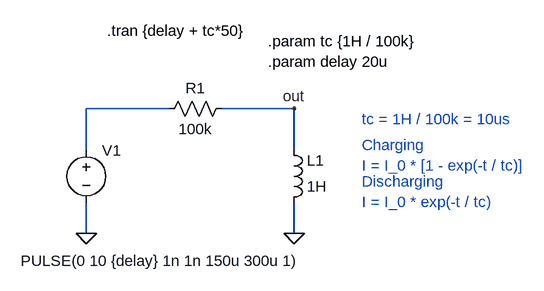
[diagram p0: schematic inductor-theory.asc]
inductor-theory.asc, the LTspice schematic file:
Version 4
SHEET 1 880 680
WIRE 256 240 128 240
WIRE 448 240 336 240
WIRE 128 304 128 240
WIRE 448 304 448 240
WIRE 128 432 128 384
WIRE 448 432 448 384
FLAG 448 432 0
FLAG 128 432 0
FLAG 448 240 out
SYMBOL voltage 128 288 R0
WINDOW 3 -101 186 Left 2
SYMATTR InstName V1
SYMATTR Value PULSE(0 10 {delay} 1n 1n 150u 300u 1)
SYMBOL Res 352 224 R90
WINDOW 0 0 56 VBottom 2
WINDOW 3 32 56 VTop 2
SYMATTR InstName R1
SYMATTR Value 100k
SYMBOL ind 432 400 M180
WINDOW 0 36 80 Left 2
WINDOW 3 36 40 Left 2
SYMATTR InstName L1
SYMATTR Value 1H
TEXT 160 120 Left 2 !.tran {delay + tc*50}
TEXT 552 256 Left 2 ;tc = 1H / 100k = 10us
TEXT 408 136 Left 2 !.param tc {1H / 100k}\n.param delay 20u
TEXT 552 296 Left 2 ;Charging\nI = I_0 * [1 - exp(-t / tc)]
TEXT 552 352 Left 2 ;Discharging\nI = I_0 * exp(-t / tc)

The netlist it stands for:
* inductor-theory.asc
V1 N001 0 PULSE(0 10 {delay} 1n 1n 150u 300u 1)
R1 out N001 100k
L1 0 out 1H
.tran {delay + tc*50}
* tc = 1H / 100k = 10us
.param tc {1H / 100k}
.param delay 20u
* Charging
* I = I_0 * [1 - exp(-t / tc)]
* Discharging
* I = I_0 * exp(-t / tc)
.backanno
.end